# Altium project uz_per_thermocoupler_connector.PrjPcb
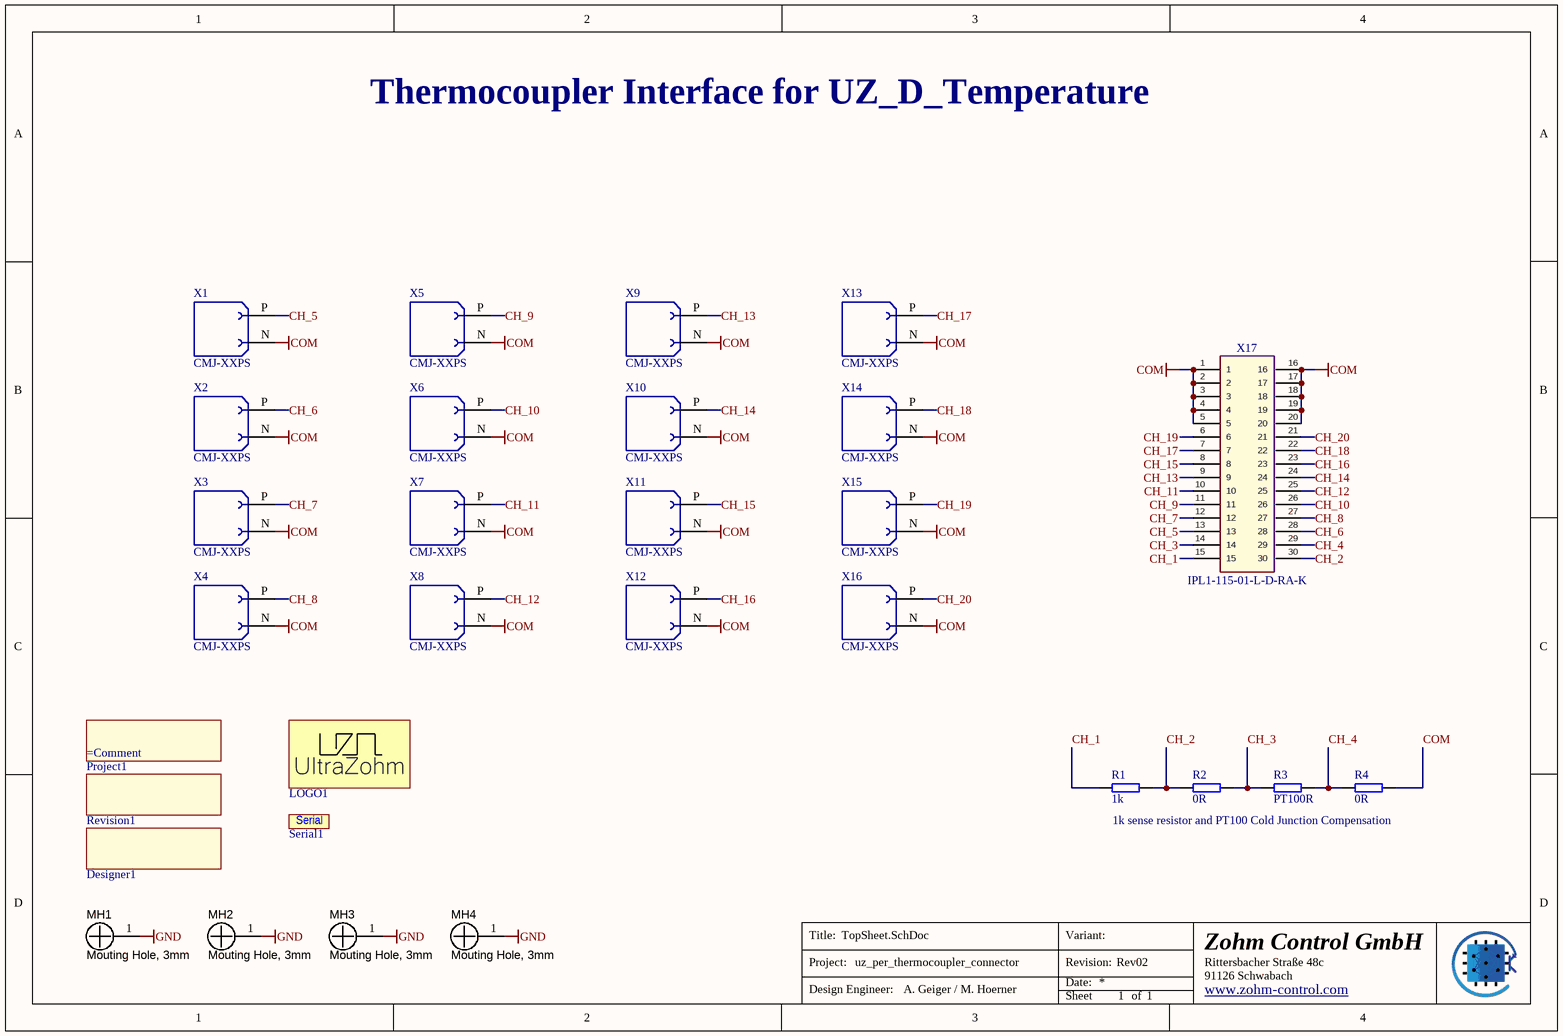
[diagram p0: TopSheet.SchDoc]
ProjectRevision: Rev02; ProjectNameCustom: =ProjectName; ProjectName: uz_per_thermocoupler_connector; ProjectDate: 08/2023; AuthorParam: A. Geiger / M. Hoerner
1 sheet, 30 parts. Net scope: global (net labels, ports and power ports of the same name join across sheets).
Board file: uz_per_thermocoupler_connector.PcbDoc

## Sheet TopSheet.SchDoc
size A4; Author: A. Geiger / M. Hoerner; CompanyName: Zohm Control GmbH; Address1: Rittersbacher Straße 48c; Address2: 91126 Schwabach; Address3: GERMANY; SheetNumber: 1; SheetTotal: 1; Website: www.zohm-control.com

### Parts
Designer1  (no value)  [Designator:comment]  (no BOM)
LOGO1  UZ Logo  [UZ_Logo_medium]  (value not drawn)  (no BOM)
MH1  Mouting Hole, 3mm  [NY PMS 440 0025 PH]
MH2  Mouting Hole, 3mm  [NY PMS 440 0025 PH]
MH3  Mouting Hole, 3mm  [NY PMS 440 0025 PH]
MH4  Mouting Hole, 3mm  [NY PMS 440 0025 PH]
Project1  (no value)  [COMMENT]  (no BOM)
R1  1k  [RES 0603_1608]
R2  0R  [RES 0603_1608]
R3  PT100R  [RES 0603_1608]
R4  0R  [RES 0603_1608]
Revision1  (no value)  [Designator:comment]  (no BOM)
Serial1  Serial #  [SERIAL]  (value not drawn)  (no BOM)
X1  CMJ-XXPS  [CMJ-XXPS]
X2  CMJ-XXPS  [CMJ-XXPS]
X3  CMJ-XXPS  [CMJ-XXPS]
X4  CMJ-XXPS  [CMJ-XXPS]
X5  CMJ-XXPS  [CMJ-XXPS]
X6  CMJ-XXPS  [CMJ-XXPS]
X7  CMJ-XXPS  [CMJ-XXPS]
X8  CMJ-XXPS  [CMJ-XXPS]
X9  CMJ-XXPS  [CMJ-XXPS]
X10  CMJ-XXPS  [CMJ-XXPS]
X11  CMJ-XXPS  [CMJ-XXPS]
X12  CMJ-XXPS  [CMJ-XXPS]
X13  CMJ-XXPS  [CMJ-XXPS]
X14  CMJ-XXPS  [CMJ-XXPS]
X15  CMJ-XXPS  [CMJ-XXPS]
X16  CMJ-XXPS  [CMJ-XXPS]
X17  IPL1-115-01-L-D-RA-K  [IPL1-115-01-XX-D-RA]

### Nets
COM: R4.2 X1.N(NEG) X2.N(NEG) X3.N(NEG) X4.N(NEG) X5.N(NEG) X6.N(NEG) X7.N(NEG) X8.N(NEG) X9.N(NEG) X10.N(NEG) X11.N(NEG) X12.N(NEG) X13.N(NEG) X14.N(NEG) X15.N(NEG) X16.N(NEG) X17.1 X17.2 X17.3 X17.4 X17.5 X17.16 X17.17 X17.18 X17.19 X17.20
GND: MH1.1 MH2.1 MH3.1 MH4.1
CH_1: R1.1 X17.15
CH_2: R1.2 R2.1 X17.30
CH_3: R2.2 R3.1 X17.14
CH_4: R3.2 R4.1 X17.29
CH_5: X1.P(POS) X17.13
CH_6: X2.P(POS) X17.28
CH_7: X3.P(POS) X17.12
CH_8: X4.P(POS) X17.27
CH_9: X5.P(POS) X17.11
CH_10: X6.P(POS) X17.26
CH_11: X7.P(POS) X17.10
CH_12: X8.P(POS) X17.25
CH_13: X9.P(POS) X17.9
CH_14: X10.P(POS) X17.24
CH_15: X11.P(POS) X17.8
CH_16: X12.P(POS) X17.23
CH_17: X13.P(POS) X17.7
CH_18: X14.P(POS) X17.22
CH_19: X15.P(POS) X17.6
CH_20: X16.P(POS) X17.21

### Notes on the sheet
- Thermocoupler Interface for UZ_D_Temperature
- 1k sense resistor and PT100 Cold Junction Compensation
- Title:
- Project:
- Date:
- Revision:
- Variant:
- Design Engineer:
- Sheet
- of
- (in symbol 6) Serial

### Library data of the parts
Designer1 = 4: Create a project parameter named "Author" this is the value of this component. It is printed on the PCB. Once the parameter is updated (e.g. new revision) it gets updated on the PCB as well; Manufacturer: PCB Manufacturer; Manufacturer Part Number: Project Author; Created from: T. Wendt; PartID: 4; Created On: 01.03.2021 08:53:41; Component Type: Project Author; Last Updated: 01.03.2021 09:20:27; Type: Standard (No BOM); Value: =AuthorParam; Live Cycle Status: 1
LOGO1 = 1: Official Project Logo of the UltraZohm; Manufacturer: PCB Manufacturer; Manufacturer Part Number: UltraZohm Logo; Created from: T. Wendt; PartID: 1; Created On: 19.02.2021 16:55:56; ComponentLink1Description: Homepage; ComponentLink1URL: https://ultrazohm.com; Component Type: Logo; Last Updated: 02.03.2021 14:31:24; Type: Standard (No BOM); Live Cycle Status: 1
MH1-MH4 = NY PMS 440 0025 PH: Machine Screw, Round, #4-40 x 1/4, Nylon, Philips panhead; MF: B&F Fastener Supply; MPN: NY PMS 440 0025 PH; Package: Screw; ComponentLink1Description: Datasheet Link; ComponentLink1URL: http://www.fasnetdirect.com/refguide/Nylpanms.pdf; Created: 2021_06_22_AGeiger; Supplier 1: Digi-Key; Supplier Part Number 1: H542-ND; Value: Mouting Hole, 3mm
Project1 = 2: Create a project parameter named "ProjectNameCustom" this is the value of this component and it is printed on the PCB.; Manufacturer: PCB Manufacturer; Created from: T. Wendt; PartID: 2; Created On: 01.03.2021 08:43:57; Component Type: Project Name; Last Updated: 01.03.2021 09:07:27; Manufacturer Part Number: Project Name; Type: Standard (No BOM); Value: =ProjectName; Live Cycle Status: 1
R1 = AR03BTCX1001: 100mW ±0.1% ±25ppm/℃ 1kΩ 0603 Chip Resistor - Surface Mount ROHS; Manufacturer: Viking Tech; Created from: AGeiger; Manufacturer Part Number: AR03BTCX1001; PartID: 240; Created On: 03.09.2022 10:12:43; ComponentLink1Description: Datasheet; ComponentLink1URL: https://datasheet.lcsc.com/lcsc/2011191435_Viking-Tech-AR03BTCX1001_C304069.pdf; Component Type: SMD resistor; Device Package: 0603; Last Updated: 03.09.2022 10:12:43; Mounting Type: SMD; Supplier 1: LCSC; Supplier Part Number 1: C304069; Type: Resistor; Tolerance: 0.1%; Value: 1k; Live Cycle Status: 1; LCSC Part Number: C304069
R2 R4 = RC0603JR-070RL: SMD resistor E24 series; Manufacturer: YAGEO; Tolerance: 5%; Created from: MGremer; Manufacturer Part Number: RC0603JR-070RL; PartID: 1; Created On: 14.12.2020 16:17:14; ComponentLink1Description: Datasheet; ComponentLink1URL: https://www.mouser.de/datasheet/2/447/PYu-RC_Group_51_RoHS_L_10-1664068.pdf; Component Type: SMD resistor; Device Package: 0603; Last Updated: 04.03.2021 09:09:42; Mounting Type: SMD; Supplier 1: Mouser; Supplier Part Number 1: 603-RC0603JR-070RL; Supplier 2: LCSC; Supplier Part Number 2: C21189; Type: Resistor; Value: 0R; Live Cycle Status: 1; Stock number: Labor SMD Container; LCSC Part Number: C21189
R3 = PTS060301B100RPU00: SMD resistor PT100; Manufacturer: Vishay; Tolerance: 0.3%; Created from: MHoerner; Manufacturer Part Number: PTS060301B100RPU00; PartID: 294; Created On: 08.08.2023 14:34:57; ComponentLink1Description: Datasheet; ComponentLink1URL: https://www.tme.eu/Document/7a1944d11c62928060478235d4de5eb3/Pt100-SMD.pdf; Component Type: SMD resistor; Device Package: 0603; Last Updated: 08.08.2023 14:40:38; Mounting Type: SMD; Supplier 1: TME; Supplier Part Number 1: PTS-0603-B-PU-100R; Type: Resistor; Value: PT100R; Live Cycle Status: 1; Stock number: not stored; LCSC Part Number: C141518
Revision1 = 3: Create a project parameter named "ProjectRevision" this is the value of this component. It is printed on the PCB. Once the parameter is updated (e.g. new revision) it gets updated on the PCB as well; Manufacturer: PCB Manufacturer; Value: Rev02; Created from: T. Wendt; PartID: 3; Created On: 01.03.2021 08:50:34; Component Type: Project Revision; Last Updated: 01.03.2021 09:28:36; Manufacturer Part Number: Project Revision; Type: Standard (No BOM); Live Cycle Status: 1
Serial1 = 6: Field to put in a serial number; Manufacturer: PCB Manufacturer; Created from: T. Wendt; PartID: 6; Created On: 02.03.2021 14:31:24; Component Type: Serial Number; Last Updated: 02.03.2021 14:31:24; Manufacturer Part Number: Serial Number; Type: Standard (No BOM); Live Cycle Status: 1
X1-X16 = CMJ-XXPS: Connector Miniature Jack PCB Side Mounting; Manufacturer Part Number: CMJ-XXPS
X17 = IPL1-115-01-L-D-RA-K: Terminal Assembly, Double Row, Right Angle, Thru-Hole, 2.54 mm x 2.54 mm Pitch, 30 Pins; Manufacturer: SAMTEC; Created from: TWendt; Number of positions: 30; Manufacturer Part Number: IPL1-115-01-L-D-RA-K; PartID: 34; Created On: 12.02.2021 15:31:18; ComponentLink1Description: Homepage; ComponentLink1URL: https://www.samtec.com/products/ipl1; Component Type: Samtec Connector; Device Package: Connector; Last Updated: 15.02.2021 10:07:42; Supplier 1: SAMTEC; Supplier Part Number 1: IPL1-115-01-L-D-RA-K; Type: Connector; Live Cycle Status: 1; Number of rows: 2; Stock number: not stored; LCSC Part Number: C7423882